# EAGLE board video-max3000a (EAGLE 5.11)
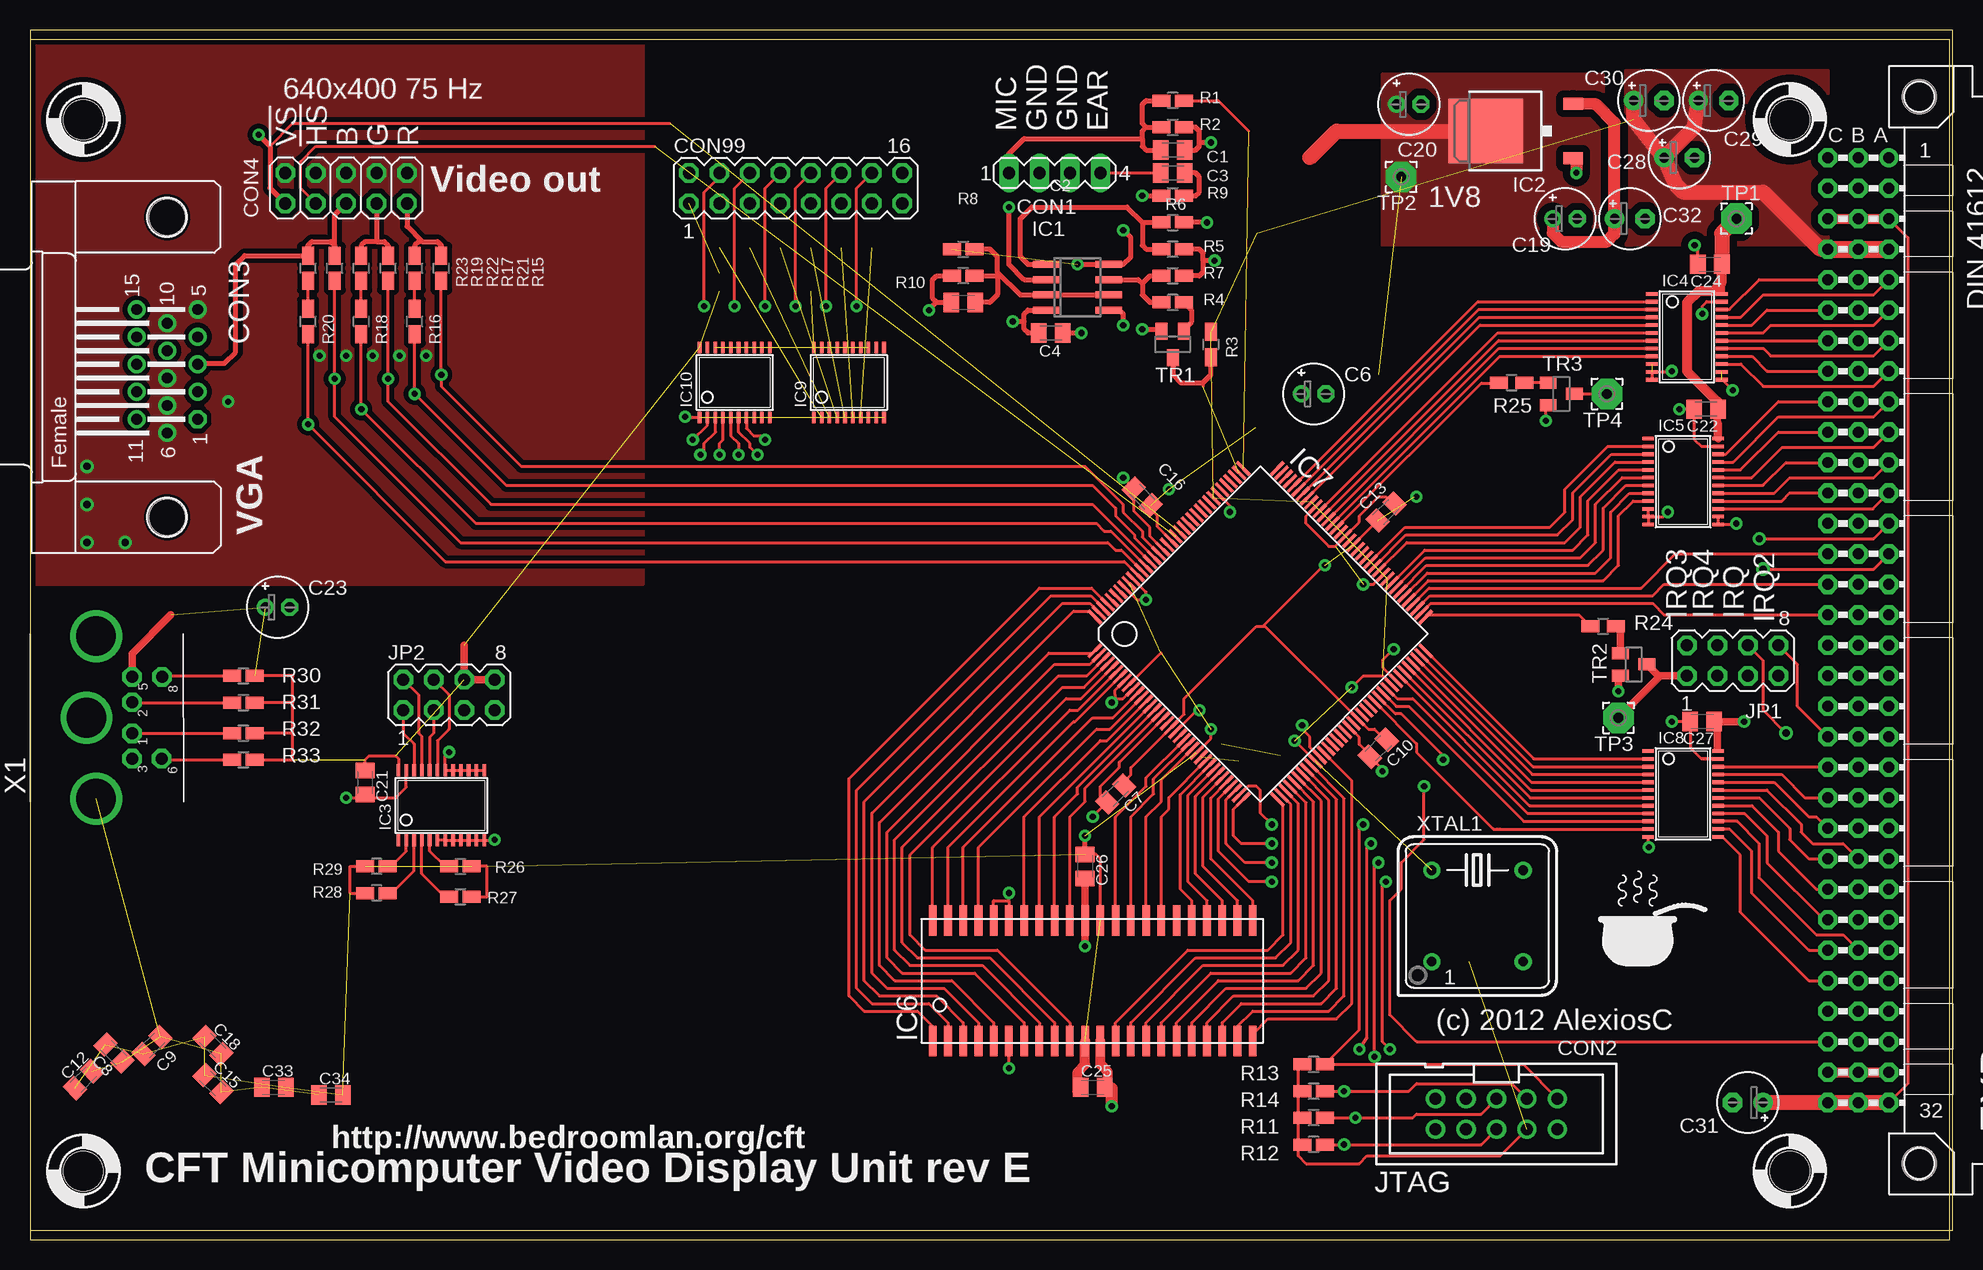
[diagram p4: board, top side]
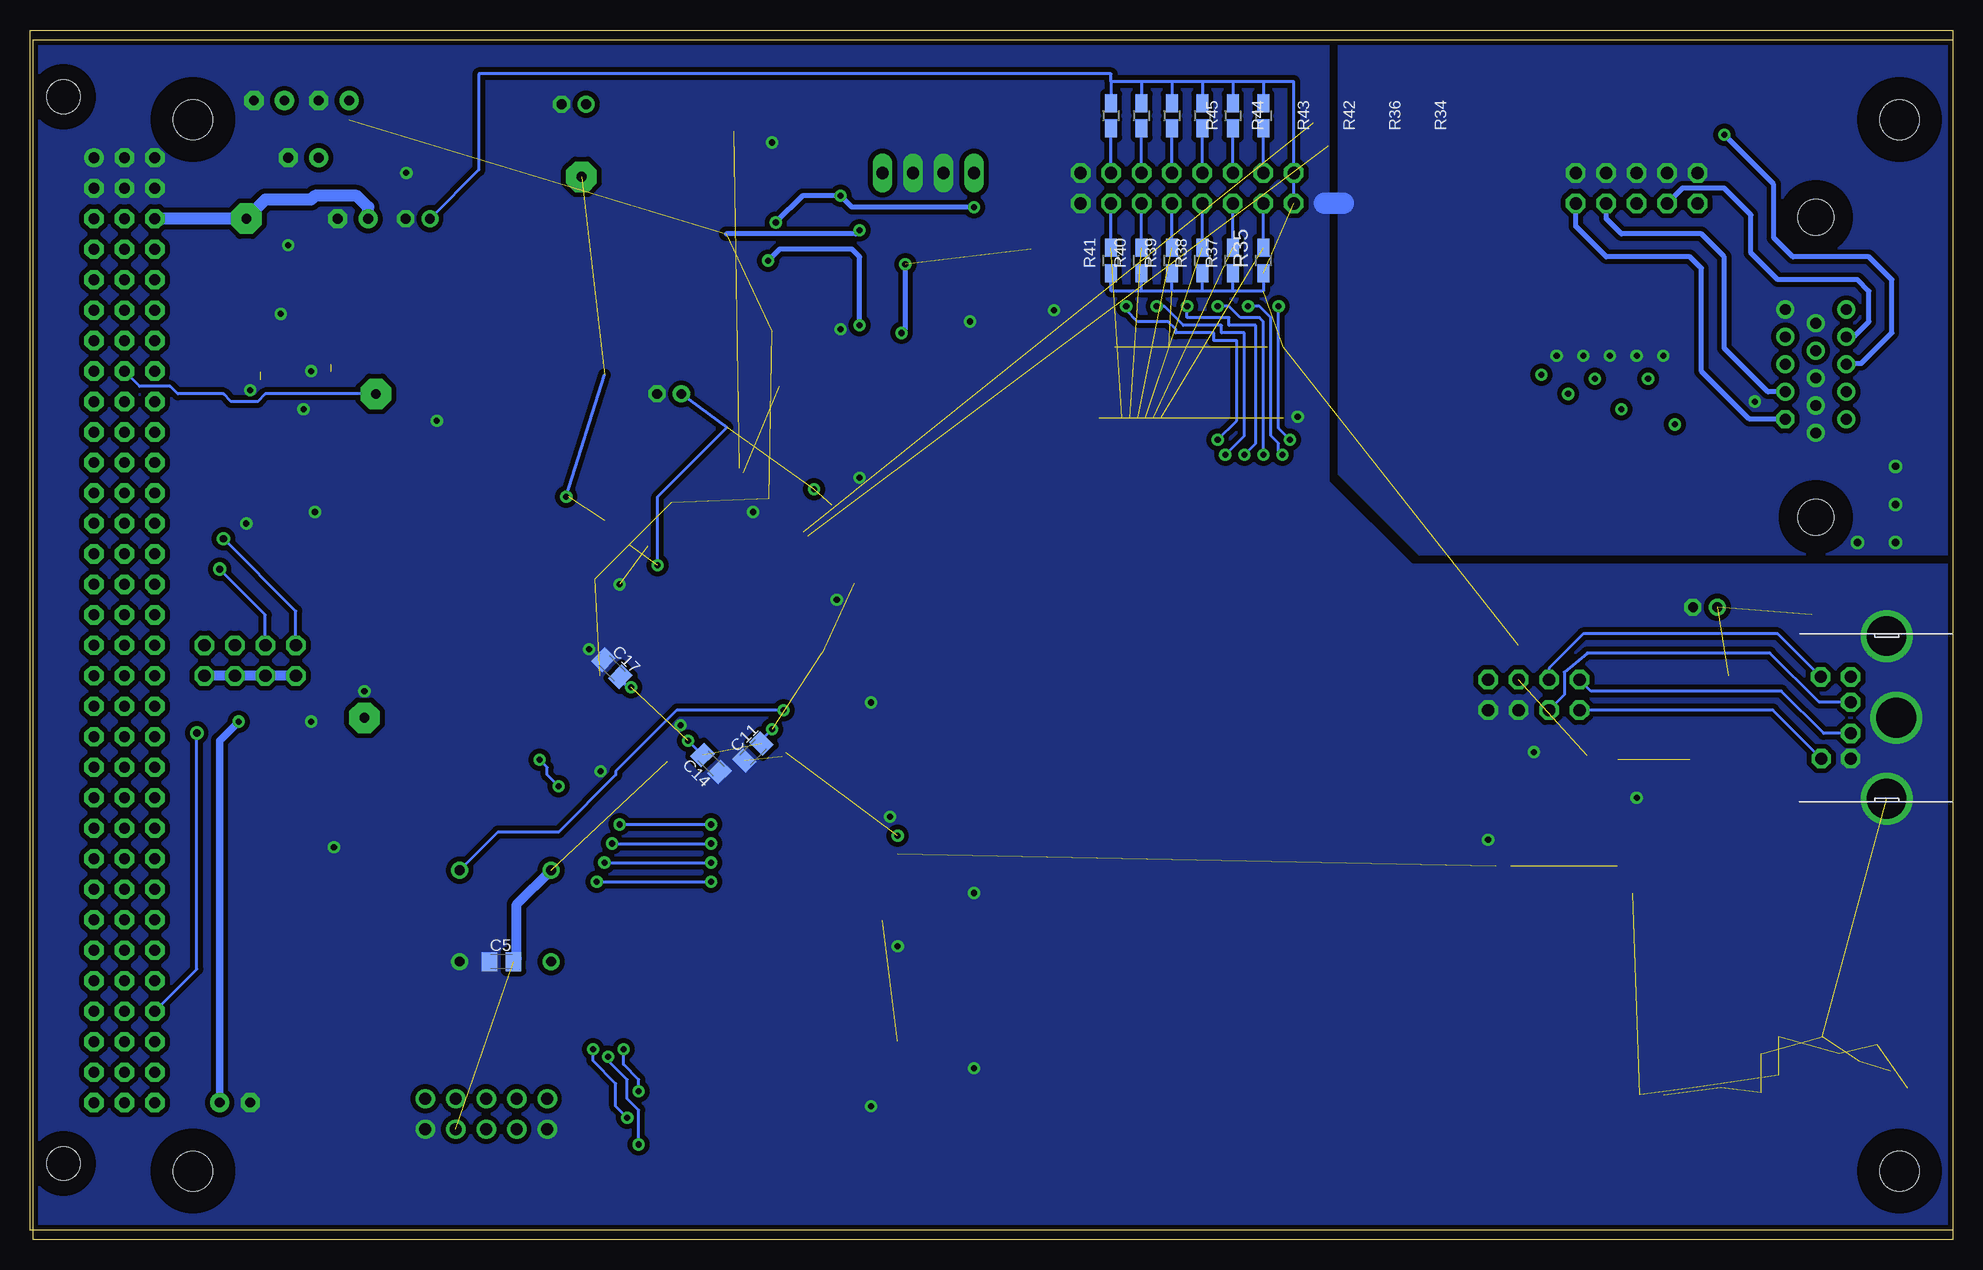
[diagram p5: board, bottom side, seen from below]

Size 160 x 100 mm. Coordinates in mm from the lower left corner, seen from the top.
Outline: 0,0 160,0 160,100 0,100 0,0
Copper layers (1*16): Top 0.035mm / dielectric 1.5mm / Bottom 0.035mm
Design rules "SparkFun": minimum track width 8mil, minimum drill 20mil, track to track 8mil, track to pad 8mil, pad to pad 8mil, via to via 8mil, smd to smd 8mil, copper to edge 10mil, drill to drill 8mil, minimum pad ring 12mil, minimum via ring 10mil, stop-mask expansion 4mil, vias tented up to drill 25mil, thermal gap 10mil
Net classes: 0 default: width 0.254 mm, clearance 0.203 mm; 1 low power: width 1.27 mm, clearance 0.254 mm; 2 LED power: width 1.93 mm, clearance 0.254 mm; 3 3.3V power: width 0.61 mm, clearance 0.203 mm; 4 Analogue: width 0.406 mm, clearance 0.305 mm

## Footprints (pad centres in the part's own frame; a part is rotated, then mirrored left to right if it is on the bottom)
C0805K = smd 1.3 x 1.6: 1 -1,0; 2 1,0
E2-5 = drill 0.813 pad 1.27 round: + -1.016,0 | drill 0.813 pad 1.27 octagon: - 1.016,0
E2,5-5 = drill 0.813 pad 1.6 round: + -1.27,0 | drill 0.813 pad 1.6 octagon: - 1.27,0
MA04-1 = drill 1.016 long: 1 -3.81,0; 2 -1.27,0; 3 1.27,0; 4 3.81,0
SHROUDED-HEADER-2X5-2.5MM = drill 1 pad 1.422 round: 1 -5.08,-1.27; 2 -5.08,1.27; 3 -2.54,-1.27; 4 -2.54,1.27; 5 0,-1.27; 6 0,1.27; 7 2.54,-1.27; 8 2.54,1.27; 9 5.08,-1.27; 10 5.08,1.27
HDF15H = drill 0.9 octagon: 1 4.329,2.54 | drill 0.9 round: 2 2.043,2.54; 3 -0.243,2.54; 4 -2.529,2.54; 5 -4.815,2.54; 6 5.472,0; 7 3.186,0; 8 0.9,0; 9 -1.386,0; 10 -3.672,0; 11 4.329,-2.54; 12 2.043,-2.54; 13 -0.243,-2.54; 14 -2.529,-2.54; 15 -4.815,-2.54 | hole 3: -12.5,0; 12.5,0
2X05 = drill 1.016 octagon: 1 -5.08,-1.27; 2 -5.08,1.27; 3 -2.54,-1.27; 4 -2.54,1.27; 5 0,-1.27; 6 0,1.27; 7 2.54,-1.27; 8 2.54,1.27; 9 5.08,-1.27; 10 5.08,1.27
MA08-2 = drill 1.016 octagon: 1 -8.89,-1.27; 2 -8.89,1.27; 3 -6.35,-1.27; 4 -6.35,1.27; 5 -3.81,-1.27; 6 -3.81,1.27; 7 -1.27,-1.27; 8 -1.27,1.27; 9 1.27,-1.27; 10 1.27,1.27; 11 3.81,-1.27; 12 3.81,1.27; 13 6.35,-1.27; 14 6.35,1.27; 15 8.89,-1.27; 16 8.89,1.27
VG96K = drill 0.914 pad 1.6 round: A1 154.94,39.37 | drill 0.914 pad 1.6 octagon: A2 154.94,36.83; A3 154.94,34.29; A4 154.94,31.75; A5 154.94,29.21; A6 154.94,26.67; A7 154.94,24.13; A8 154.94,21.59; A9 154.94,19.05; A10 154.94,16.51; A11 154.94,13.97; A12 154.94,11.43; A13 154.94,8.89; A14 154.94,6.35; A15 154.94,3.81; A16 154.94,1.27; A17 154.94,-1.27; A18 154.94,-3.81; A19 154.94,-6.35; A20 154.94,-8.89; A21 154.94,-11.43; A22 154.94,-13.97; A23 154.94,-16.51; A24 154.94,-19.05; A25 154.94,-21.59; A26 154.94,-24.13; A27 154.94,-26.67; A28 154.94,-29.21; A29 154.94,-31.75; A30 154.94,-34.29; A31 154.94,-36.83; A32 154.94,-39.37; B1 152.4,39.37; B2 152.4,36.83; B3 152.4,34.29; B4 152.4,31.75; B5 152.4,29.21; B6 152.4,26.67; B7 152.4,24.13; B8 152.4,21.59; B9 152.4,19.05; B10 152.4,16.51; B11 152.4,13.97; B12 152.4,11.43; B13 152.4,8.89; B14 152.4,6.35; B15 152.4,3.81; B16 152.4,1.27; B17 152.4,-1.27; B18 152.4,-3.81; B19 152.4,-6.35; B20 152.4,-8.89; B21 152.4,-11.43; B22 152.4,-13.97; B23 152.4,-16.51; B24 152.4,-19.05; B25 152.4,-21.59; B26 152.4,-24.13; B27 152.4,-26.67; B28 152.4,-29.21; B29 152.4,-31.75; B30 152.4,-34.29; B31 152.4,-36.83; B32 152.4,-39.37; C1 149.86,39.37; C2 149.86,36.83; C3 149.86,34.29; C4 149.86,31.75; C5 149.86,29.21; C6 149.86,26.67; C7 149.86,24.13; C8 149.86,21.59; C9 149.86,19.05; C10 149.86,16.51; C11 149.86,13.97; C12 149.86,11.43; C13 149.86,8.89; C14 149.86,6.35; C15 149.86,3.81; C16 149.86,1.27; C17 149.86,-1.27; C18 149.86,-3.81; C19 149.86,-6.35; C20 149.86,-8.89; C21 149.86,-11.43; C22 149.86,-13.97; C23 149.86,-16.51; C24 149.86,-19.05; C25 149.86,-21.59; C26 149.86,-24.13; C27 149.86,-26.67; C28 149.86,-29.21; C29 149.86,-31.75; C30 149.86,-34.29; C31 149.86,-36.83; C32 149.86,-39.37 | hole 2.794: 157.48,44.45; 157.48,-44.45
STANDOFF_28_60 = hole 3.302: 0,0
SO08 = smd 0.6 x 2.2: 1 -1.905,-2.6; 2 -0.635,-2.6; 3 0.635,-2.6; 4 1.905,-2.6; 5 1.905,2.6; 6 0.635,2.6; 7 -0.635,2.6; 8 -1.905,2.6
TO252 = smd 1 x 1.6: 1 -2.28,-4.8; 2 2.28,-4.8 | smd 5.4 x 6.2: 3 0,2.5
TSSOP24@2 = smd 0.305 x 0.991: 1 -3.575,-2.918; 2 -2.925,-2.918; 3 -2.275,-2.918; 4 -1.625,-2.918; 5 -0.975,-2.918; 6 -0.325,-2.918; 7 0.325,-2.918; 8 0.975,-2.918; 9 1.625,-2.918; 10 2.275,-2.918; 11 2.925,-2.918; 12 3.575,-2.918; 13 3.575,2.918; 14 2.925,2.918; 15 2.275,2.918; 16 1.625,2.918; 17 0.975,2.918; 18 0.325,2.918; 19 -0.325,2.918; 20 -0.975,2.918; 21 -1.625,2.918; 22 -2.275,2.918; 23 -2.925,2.918; 24 -3.575,2.918
TSSOP24@1 = smd 0.305 x 0.991: 1 -3.575,-2.918; 2 -2.925,-2.918; 3 -2.275,-2.918; 4 -1.625,-2.918; 5 -0.975,-2.918; 6 -0.325,-2.918; 7 0.325,-2.918; 8 0.975,-2.918; 9 1.625,-2.918; 10 2.275,-2.918; 11 2.925,-2.918; 12 3.575,-2.918; 13 3.575,2.918; 14 2.925,2.918; 15 2.275,2.918; 16 1.625,2.918; 17 0.975,2.918; 18 0.325,2.918; 19 -0.325,2.918; 20 -0.975,2.918; 21 -1.625,2.918; 22 -2.275,2.918; 23 -2.925,2.918; 24 -3.575,2.918
SOJ44-4 = smd 0.635 x 2.54: 1 -10.16,-5.029; 2 -8.89,-5.029; 3 -7.62,-5.029; 4 -6.35,-5.029; 5 -5.08,-5.029; 6 -3.81,-5.029; 7 -2.54,-5.029; 8 -1.27,-5.029; 9 0,-5.029; 10 1.27,-5.029; 11 2.54,-5.029; 12 3.81,-5.029; 13 5.08,-5.029; 14 6.35,-5.029; 15 7.62,-5.029; 16 8.89,-5.029; 17 10.16,-5.029; 18 11.43,-5.029; 19 12.7,-5.029; 20 13.97,-5.029; 21 15.24,-5.029; 22 16.51,-5.029; 23 16.51,5.029; 24 15.24,5.029; 25 13.97,5.029; 26 12.7,5.029; 27 11.43,5.029; 28 10.16,5.029; 29 8.89,5.029; 30 7.62,5.029; 31 6.35,5.029; 32 5.08,5.029; 33 3.81,5.029; 34 2.54,5.029; 35 1.27,5.029; 36 0,5.029; 37 -1.27,5.029; 38 -2.54,5.029; 39 -3.81,5.029; 40 -5.08,5.029; 41 -6.35,5.029; 42 -7.62,5.029; 43 -8.89,5.029; 44 -10.16,5.029
TQFP144 = smd 0.27 x 1.5: 1 -8.75,-10.75; 2 -8.25,-10.75; 3 -7.75,-10.75; 4 -7.25,-10.75; 5 -6.75,-10.75; 6 -6.25,-10.75; 7 -5.75,-10.75; 8 -5.25,-10.75; 9 -4.75,-10.75; 10 -4.25,-10.75; 11 -3.75,-10.75; 12 -3.25,-10.75; 13 -2.75,-10.75; 14 -2.25,-10.75; 15 -1.75,-10.75; 16 -1.25,-10.75; 17 -0.75,-10.75; 18 -0.25,-10.75; 19 0.25,-10.75; 20 0.75,-10.75; 21 1.25,-10.75; 22 1.75,-10.75; 23 2.25,-10.75; 24 2.75,-10.75; 25 3.25,-10.75; 26 3.75,-10.75; 27 4.25,-10.75; 28 4.75,-10.75; 29 5.25,-10.75; 30 5.75,-10.75; 31 6.25,-10.75; 32 6.75,-10.75; 33 7.25,-10.75; 34 7.75,-10.75; 35 8.25,-10.75; 36 8.75,-10.75; 73 8.75,10.75; 74 8.25,10.75; 75 7.75,10.75; 76 7.25,10.75; 77 6.75,10.75; 78 6.25,10.75; 79 5.75,10.75; 80 5.25,10.75; 81 4.75,10.75; 82 4.25,10.75; 83 3.75,10.75; 84 3.25,10.75; 85 2.75,10.75; 86 2.25,10.75; 87 1.75,10.75; 88 1.25,10.75; 89 0.75,10.75; 90 0.25,10.75; 91 -0.25,10.75; 92 -0.75,10.75; 93 -1.25,10.75; 94 -1.75,10.75; 95 -2.25,10.75; 96 -2.75,10.75; 97 -3.25,10.75; 98 -3.75,10.75; 99 -4.25,10.75; 100 -4.75,10.75; 101 -5.25,10.75; 102 -5.75,10.75; 103 -6.25,10.75; 104 -6.75,10.75; 105 -7.25,10.75; 106 -7.75,10.75; 107 -8.25,10.75; 108 -8.75,10.75 | smd 1.5 x 0.27: 37 10.75,-8.75; 38 10.75,-8.25; 39 10.75,-7.75; 40 10.75,-7.25; 41 10.75,-6.75; 42 10.75,-6.25; 43 10.75,-5.75; 44 10.75,-5.25; 45 10.75,-4.75; 46 10.75,-4.25; 47 10.75,-3.75; 48 10.75,-3.25; 49 10.75,-2.75; 50 10.75,-2.25; 51 10.75,-1.75; 52 10.75,-1.25; 53 10.75,-0.75; 54 10.75,-0.25; 55 10.75,0.25; 56 10.75,0.75; 57 10.75,1.25; 58 10.75,1.75; 59 10.75,2.25; 60 10.75,2.75; 61 10.75,3.25; 62 10.75,3.75; 63 10.75,4.25; 64 10.75,4.75; 65 10.75,5.25; 66 10.75,5.75; 67 10.75,6.25; 68 10.75,6.75; 69 10.75,7.25; 70 10.75,7.75; 71 10.75,8.25; 72 10.75,8.75; 109 -10.75,8.75; 110 -10.75,8.25; 111 -10.75,7.75; 112 -10.75,7.25; 113 -10.75,6.75; 114 -10.75,6.25; 115 -10.75,5.75; 116 -10.75,5.25; 117 -10.75,4.75; 118 -10.75,4.25; 119 -10.75,3.75; 120 -10.75,3.25; 121 -10.75,2.75; 122 -10.75,2.25; 123 -10.75,1.75; 124 -10.75,1.25; 125 -10.75,0.75; 126 -10.75,0.25; 127 -10.75,-0.25; 128 -10.75,-0.75; 129 -10.75,-1.25; 130 -10.75,-1.75; 131 -10.75,-2.25; 132 -10.75,-2.75; 133 -10.75,-3.25; 134 -10.75,-3.75; 135 -10.75,-4.25; 136 -10.75,-4.75; 137 -10.75,-5.25; 138 -10.75,-5.75; 139 -10.75,-6.25; 140 -10.75,-6.75; 141 -10.75,-7.25; 142 -10.75,-7.75; 143 -10.75,-8.25; 144 -10.75,-8.75
TSSOP20 = smd 0.305 x 0.991: 1 -2.925,-2.918; 2 -2.275,-2.918; 3 -1.625,-2.918; 4 -0.975,-2.918; 5 -0.325,-2.918; 6 0.325,-2.918; 7 0.975,-2.918; 8 1.625,-2.918; 9 2.275,-2.918; 10 2.925,-2.918; 11 2.925,2.918; 12 2.275,2.918; 13 1.625,2.918; 14 0.975,2.918; 15 0.325,2.918; 16 -0.325,2.918; 17 -0.975,2.918; 18 -1.625,2.918; 19 -2.275,2.918; 20 -2.925,2.918
MA04-2 = drill 1.016 octagon: 1 -3.81,-1.27; 2 -3.81,1.27; 3 -1.27,-1.27; 4 -1.27,1.27; 5 1.27,-1.27; 6 1.27,1.27; 7 3.81,-1.27; 8 3.81,1.27
R0805W = smd 1.5 x 1: 1 -0.94,0; 2 0.94,0
R0805W' = smd 1.5 x 1: 1 -1.052,0; 2 1.052,0
2,54/0,8 = drill 0.813 pad 2.54 octagon: 1 0,0
SOT23 = smd 1 x 1.4: 1 -0.95,-1.1; 2 0.95,-1.1; 3 0,1.1
M_DIN6 = drill 1 pad 1.422 octagon: 1 -1.3,-3.75; 2 1.3,-3.75; 3 -3.4,-3.75; 5 3.4,-3.75; 6 -3.4,-6.2; 8 3.4,-6.25 | drill 3.3 pad 3.5 round: SH1 6.8,-0.75; SH2 0,0.05; SH3 -6.75,-0.75
DIL08S = drill 0.813 round: 1 -3.81,-3.81; 4 3.81,-3.81; 5 3.81,3.81; 8 -3.81,3.81

## Placement (x,y rotation side)
C1  100nF  [C0805K]  95.25,90.81 0 top
C2  100nF  [C0805K]  77.79,78.11 180 top
C3  47nF  [C0805K]  95.25,88.9 180 top
C4  0.1uF  [C0805K]  85.09,75.56 0 top
C5  0.1uF  [C0805K]  120.97,23.18 0 bottom
C6  10uF  [E2-5]  107,70.48 0 top
C7  0.1uF  [C0805K]  90.49,37.15 45 top
C8  0.1uF  [C0805K]  6.99,15.56 135 top
C9  0.1uF  [C0805K]  10.16,16.19 45 top
C10  0.1uF  [C0805K]  112.39,40.96 45 top
C11  0.1uF  [C0805K]  100.01,40.64 45 bottom
C12  0.1uF  [C0805K]  4.45,13.34 45 top
C13  0.1uF  [C0805K]  113.03,60.64 225 top
C14  0.1uF  [C0805K]  103.5,39.69 135 bottom
C15  0.1uF  [C0805K]  15.24,13.02 315 top
C16  0.1uF  [C0805K]  92.71,61.91 315 top
C17  0.1uF  [C0805K]  111.76,47.62 315 bottom
C18  0.1uF  [C0805K]  15.24,16.19 315 top
C19  10uF  [E2-5]  127.95,85.09 0 top
C20  22uF  [E2-5]  114.94,94.61 0 top
C21  0.1uF  [C0805K]  27.94,38.1 270 top
C22  0.1uF  [C0805K]  139.7,69.22 180 top
C23  10uF  [E2-5]  20.64,52.7 0 top
C24  0.1uF  [C0805K]  140.02,81.28 180 top
C25  0.1uF  [C0805K]  88.58,12.7 0 top
C26  0.1uF  [C0805K]  87.95,31.11 270 top
C27  0.1uF  [C0805K]  139.38,43.18 180 top
C28  1uF  [E2,5-5]  137.48,90.17 0 top
C29  1uF  [E2,5-5]  140.34,94.93 0 top
C30  1uF  [E2,5-5]  134.94,94.93 0 top
C31  1uF  [E2,5-5]  143.19,11.43 180 top
C32  1uF  [E2,5-5]  133.35,85.09 0 top
C33  0.1uF  [C0805K]  20.32,12.7 0 top
C34  0.1uF  [C0805K]  25.08,12.06 0 top
CON1  [MA04-1]  85.41,88.9 0 top
CON2  JTAG-ALTERA  [SHROUDED-HEADER-2X5-2.5MM]  122.24,10.48 180 top
CON3  [HDF15H]  11.43,72.71 270 top
CON4  [2X05]  26.35,87.63 180 top
CON99  [MA08-2]  63.82,87.63 0 top
EXP  [VG96K]  0,50.8 0 top
H1  HOLE  [STANDOFF_28_60]  4.45,93.34 0 top
H2  HOLE  [STANDOFF_28_60]  146.69,93.34 0 top
H3  HOLE  [STANDOFF_28_60]  146.69,5.71 0 top
H4  HOLE  [STANDOFF_28_60]  4.45,5.71 0 top
IC1  LM358MX  [SO08]  87.31,79.38 270 top
IC2  AP1117D18  [TO252]  123.83,92.39 90 top
IC3  IDTQS3861PA  [TSSOP24@2]  34.29,36.2 0 top
IC4  IDTQS3861PA  [TSSOP24@1]  138.11,75.25 270 top
IC5  IDTQS3861PA  [TSSOP24@1]  137.79,63.18 270 top
IC6  AS7C34098A  [SOJ44-4]  85.41,21.59 0 top
IC7  5M570ZT144  [TQFP144]  102.55,50.48 315 top
IC8  IDTQS3861PA  [TSSOP24@1]  137.79,37.15 270 top
IC9  74LCX541MTC  [TSSOP20]  68.26,71.44 0 top
IC10  74LCX541MTC  [TSSOP20]  58.74,71.44 0 top
JP1  [MA04-2]  141.92,48.26 0 top
JP2  [MA04-2]  34.92,45.4 0 top
R1  22k  [R0805W]  95.25,94.93 180 top
R2  10k  [R0805W]  95.25,92.71 0 top
R3  4k7  [R0805W']  98.42,74.61 270 top
R4  10k  [R0805W]  95.25,78.11 180 top
R5  1k  [R0805W]  95.25,82.55 180 top
R6  22k  [R0805W]  95.25,84.77 0 top
R7  100k  [R0805W]  95.25,80.33 0 top
R8  10k  [R0805W]  77.79,82.55 0 top
R9  10k  [R0805W]  95.25,87 0 top
R10  10k  [R0805W]  77.79,80.33 180 top
R11  4k7  [R0805W]  107,10.16 180 top
R12  4k7  [R0805W]  107,7.94 180 top
R13  4k7  [R0805W]  107,14.61 180 top
R14  4k7  [R0805W]  107,12.38 180 top
R15  412R  [R0805W']  34.29,80.96 90 top
R16  412R  [R0805W']  32.07,76.52 90 top
R17  412R  [R0805W']  29.84,80.96 90 top
R18  412R  [R0805W']  27.62,76.52 90 top
R19  412R  [R0805W']  25.4,80.96 90 top
R20  412R  [R0805W']  23.18,76.52 90 top
R21  412R  [R0805W']  32.07,80.96 90 top
R22  412R  [R0805W']  27.62,80.96 90 top
R23  412R  [R0805W']  23.18,80.96 90 top
R24  4k7  [R0805W']  131.13,51.12 0 top
R25  4k7  [R0805W']  123.51,71.44 0 top
R26  4k7  [R0805W]  35.88,31.11 0 top
R27  4k7  [R0805W]  35.88,28.57 0 top
R28  4k7  [R0805W]  28.89,28.89 180 top
R29  4k7  [R0805W]  28.89,31.11 180 top
R30  4k7  [R0805W]  17.78,46.99 0 top
R31  4k7  [R0805W]  17.78,44.77 0 top
R32  4k7  [R0805W]  17.78,42.23 0 top
R33  4k7  [R0805W]  17.78,40.01 0 top
R34  4k7  [R0805W']  57.47,93.66 270 bottom
R35  4k7  [R0805W']  57.47,81.6 90 bottom
R36  4k7  [R0805W']  60.01,93.66 270 bottom
R37  4k7  [R0805W']  60.01,81.6 90 bottom
R38  4k7  [R0805W']  62.55,81.6 90 bottom
R39  4k7  [R0805W']  65.09,81.6 90 bottom
R40  4k7  [R0805W']  67.63,81.6 90 bottom
R41  4k7  [R0805W']  70.17,81.6 90 bottom
R42  4k7  [R0805W']  62.55,93.66 270 bottom
R43  4k7  [R0805W']  65.09,93.66 270 bottom
R44  4k7  [R0805W']  67.63,93.66 270 bottom
R45  4k7  [R0805W']  70.17,93.66 270 bottom
TP1  [2,54/0,8]  142.24,85.09 0 top
TP2  [2,54/0,8]  114.3,88.58 180 top
TP3  [2,54/0,8]  132.4,43.5 180 top
TP4  [2,54/0,8]  131.44,70.48 180 top
TR1  BC848  [SOT23]  95.25,74.61 180 top
TR2  BC848  [SOT23]  133.67,47.94 270 top
TR3  BC848  [SOT23]  127.64,70.48 270 top
U$1  SIGNATURESILK  [SIGNATURE]  131.13,22.54 0 top
X1  [M_DIN6]  4.76,43.5 90 top
XTAL1  50.000 MHz  [DIL08S]  120.65,26.99 0 top

## Tracks (layer width: path | path; a pad name or v marks a point on that pad's centre or on a via)
!HS  (via drill 0.51)  (1 unrouted)
  Top 0.254: 20,91.12 21.91,93.03 53.34,93.03
  Top 0.406: CON4.10 20,87.63 20,91.12 v19.05,92.08
  Bottom 0.254: CON3.13 8.82,73.03
  Bottom 0.406: 8.82,73.03 7.62,73.03 5.08,75.56 5.08,80.01 6.99,81.92 13.34,81.92 14.92,83.5 14.92,87.95 v19.05,92.08
!IO
  Top 0.254: IC7.76 116.62,54.29 134.3,54.29 137.16,57.15 EXP.C14
!IODEV1XX
  Top 0.254: EXP.B24 151.13,33.02 148.59,33.02 147.64,33.97 147.64,34.61 144.78,37.47 IC8.19
!IODEV1XX-3V3
  Top 0.254: IC7.69 125.17,38.12 IC8.5
!IRQ  (via drill 0.61)
  Top 0.254: JP1.6 144.46,48.26 144.46,44.13 v146.37,42.23
  Bottom 0.254: v146.37,42.23 146.37,22.54 EXP.C29
!IRQ2
  Top 0.254: JP1.8 147.32,47.94 147.32,44.45 EXP.C20
!IRQ3  (via drill 0.61)
  Top 0.254: v144.15,58.42 153.67,58.42 EXP.A13
  Bottom 0.254: JP1.2 138.11,52.39 v144.15,58.42
!IRQ4  (via drill 0.61)
  Top 0.254: EXP.A14 153.67,55.88 v144.46,55.88
  Bottom 0.254: v144.46,55.88 140.65,52.07 JP1.4
!NPR
  Top 0.254: IC7.12 90.02,42.55 88.9,42.55 79.06,32.7 IC6.41
!NPW
  Top 0.254: IC6.17 95.57,18.1 99.06,21.59 105.73,21.59 107,22.86 107,36.49 IC7.41
!R
  Top 0.254: IC7.75 116.69,53.66 135.25,53.66 136.21,54.61 EXP.C15
!RESET  (via drill 0.51)
  Top 0.254: EXP.C30 115.57,16.51 113.35,18.73 113.35,28.26 114.3,29.21 114.3,31.43 116.2,33.34 v116.2,37.78 | IC7.61 113.82,43.81 114.3,43.81 117.79,40.32 v117.79,40.01
  Bottom 0.254: v116.2,37.78 117.16,38.73 117.16,39.37 v117.79,40.01
!T34
  Top 0.254: EXP.B27 151.13,25.4 148.91,25.4 144.15,30.16 144.15,33.02 142.29,34.87 IC8.15
!T34-3V3
  Top 0.254: IC7.63 113.96,45.09 115.25,45.09 124.81,35.52 IC8.9
!VS  (1 unrouted)
  Top 0.254: CON4.8 22.54,87.63 22.54,89.85 23.81,91.12 52.07,91.12
  Bottom 0.406: CON4.8 22.54,87.63 19.05,87.63 16.83,85.41 16.83,82.23 14.61,80.01 7.94,80.01 6.99,79.06 6.99,76.51 8.26,75.24 CON3.14
!W
  Top 0.254: EXP.C16 136.21,52.07 135.25,53.02 116.76,53.02 IC7.74
!WS
  Top 0.254: TR3.3 TP4.1
  Bottom 0.254: EXP.B8 151.13,71.12 148.59,71.12 147.96,70.48 144.15,70.48 143.51,69.85 141.29,69.85 140.65,70.48 TP4.1
+3V3  (via drill 0.51)  (24 unrouted)
  Top 0.254: 87.31,12.29 C25.1 | R14.2 106.05,12.38 105.73,12.7 | 105.73,12.7 105.73,14.29 106.05,14.61 R13.2 | 105.73,12.7 105.73,10.48 106.05,10.16 | 106.05,10.16 R11.2 | 106.05,10.16 105.73,9.84 105.73,8.26 106.05,7.94 R12.2 | R12.2 105.74,7.95 | IC7.9 94.25,48.9 94.3,48.9 | IC7.25 98.42,41.76 v98.42,42.55 | IC7.46 105.43,41.59 v105.41,41.59 | IC7.64 112.76,46.99 111.12,46.99 v110.17,46.04 | R29.2 26.67,31.11 26.67,28.89 R28.2 | R26.2 38.1,31.11 38.1,28.57 R27.2 | IC6.33 89.22,31.75 88.85,32.12 C26.1 | 105.73,7.62 105.73,6.99 106.36,6.35 110.81,6.35 111.44,6.99 122.56,6.99 CON2.4 | 105.73,7.62 105.41,7.94 | 105.73,7.62 105.74,7.62 R12.2 | 86.04,76.2 86.04,75.61 C4.2
  Top 0.406: C26.1 v87.95,33.66 | v91.12,84.14 91.76,83.5 91.76,81.92 91.12,81.28 IC1.8 v87.31,81.28 | C4.2 v87.63,75.56
  Top 0.813: 87.31,12.29 87.31,13.97 87.95,14.61 IC6.11
  Top 1.27: EXP.C4 149.22,82.55 144.46,87.31 137.79,87.31 137.16,87.95 C28.+ | C28.+ 138.75,92.71 C29.+ | C30.+ 133.67,93.34 C28.+
  Top 1.422: EXP.C4 EXP.B4 EXP.A4
  Bottom 0.254: C11.2 99.31,41.66 v98.42,42.55 | C14.2 v105.41,41.59 | C14.2 | C17.2 110.49,46.04 v110.17,46.04
  Bottom 0.406: v91.12,84.14 91.44,83.82 102.23,83.82 | v87.31,81.28 87.31,75.88 v87.63,75.56
  Bottom 0.813: XTAL1.8 119.7,27.94 119.7,23.45 C5.2
  pour Top (isolate 0.61, no thermals): 149.86,97.47 149.86,82.87 133.03,82.87 133.03,97.47
+12V
  Top 0.813: EXP.C31 EXP.B31 EXP.A31
AB0
  Top 0.254: IC4.21 142.59,76.87 144.46,78.74 153.67,78.74 EXP.A5
AB0-3V3
  Top 0.254: IC7.103 120.75,77.52 IC4.3
AB1
  Top 0.254: IC4.19 144.47,75.57 145.1,76.2 153.67,76.2 EXP.A6
AB1-3V3
  Top 0.254: IC7.101 120.87,76.22 IC4.5
AB2
  Top 0.254: IC4.17 144.49,74.27 145.1,73.66 153.67,73.66 EXP.A7
AB2-3V3
  Top 0.254: IC7.97 122.4,74.92 IC4.7
AB3
  Top 0.254: EXP.A8 153.67,71.12 144.46,71.12 142.61,72.97 IC4.15
AB3-3V3
  Top 0.254: IC4.9 124.14,73.62 124.11,73.62 122.51,73.62 IC7.95
AB4
  Top 0.254: IC5.21 141.96,64.81 145.73,68.58 153.67,68.58 EXP.A9
AB4-3V3
  Top 0.254: IC5.3 131.81,65.46 128.59,62.23 128.59,60.01 127.32,58.74 114.7,58.74 IC7.85
AB5
  Top 0.254: IC5.19 143.52,63.51 146.05,66.04 153.67,66.04 EXP.A10
AB5-3V3
  Top 0.254: IC7.81 116.25,57.47 128.59,57.47 129.86,58.74 129.86,61.59 132.42,64.16 IC5.5
AB6
  Top 0.254: IC5.17 145.39,62.21 146.69,63.5 153.67,63.5 EXP.A11
AB6-3V3
  Top 0.254: IC7.79 116.4,56.2 129.86,56.2 131.13,57.47 131.13,60.96 133.03,62.86 IC5.7
AB7
  Top 0.254: IC5.15 153.62,60.91 EXP.A12
AB7-3V3
  Top 0.254: IC7.77 116.54,54.93 131.13,54.93 132.4,56.2 132.4,60.33 133.63,61.56 IC5.9
B0  (via drill 0.51)
  Top 0.254: R19.1 v25.4,71.75 25.4,68.58 35.88,58.1 89.85,58.1 90.49,57.47 90.97,57.47 IC7.133
B1  (via drill 0.51)
  Top 0.254: IC7.134 91.22,56.52 34.61,56.52 v23.18,67.94 R20.1
BLUE
  Top 0.406: CON4.6 25.4,85.41 25.4,82.87 | 25.4,82.55 R19.2 25.4,82.87 | 25.4,82.87 25.08,83.19 23.5,83.19 23.18,82.87 R23.2 17.88,82.02 17.14,81.28 17.14,73.98 16.19,73.03 14.04,73.03 CON3.3
CG/!P!
  Top 0.254: IC7.6 87.36,44.13 86.68,44.13 75.25,32.7 IC6.44
CLK  (via drill 0.51)
  Top 0.254: IC7.20 97.26,44.13 v97.47,44.13
  Bottom 0.254: v97.47,44.13 106.36,44.13 111.44,39.05 111.44,38.73 116.2,33.97 121.28,33.97 XTAL1.5
DB0
  Top 0.254: IC4.22 141.66,77.52 144.15,80.01 EXP.C5
DB0-3V3
  Top 0.254: IC7.104 120.7,78.17 IC4.2
DB1
  Top 0.254: IC4.20 143.53,76.22 144.78,77.47 EXP.C6
DB1-3V3
  Top 0.254: IC7.102 120.81,76.87 IC4.4
DB2
  Top 0.254: IC4.18 EXP.C7
DB2-3V3
  Top 0.254: IC7.98 122.34,75.57 IC4.6
DB3
  Top 0.254: IC4.16 143.55,73.62 144.78,72.39 EXP.C8
DB3-3V3
  Top 0.254: IC7.96 122.45,74.27 IC4.8
DB4
  Top 0.254: IC5.22 141.34,65.46 145.73,69.85 EXP.C9
DB4-3V3
  Top 0.254: IC5.2 131.51,66.11 127.95,62.55 127.95,60.64 126.68,59.37 114.62,59.37 IC7.86
DB5
  Top 0.254: IC5.20 142.58,64.16 145.73,67.31 EXP.C10
DB5-3V3
  Top 0.254: IC5.4 132.12,64.81 129.22,61.91 129.22,59.37 127.95,58.1 114.77,58.1 IC7.84
DB6
  Top 0.254: IC5.18 144.46,62.86 146.37,64.77 EXP.C11
DB6-3V3
  Top 0.254: IC7.80 116.33,56.83 129.22,56.83 130.49,58.1 130.49,61.28 132.72,63.51 IC5.6
DB7
  Top 0.254: IC5.16 146.01,61.56 146.69,62.23 EXP.C12
DB7-3V3
  Top 0.254: IC5.8 133.33,62.21 131.76,60.64 131.76,56.83 130.49,55.56 116.47,55.56 IC7.78
DB8
  Top 0.254: IC8.22 149.81,39.42 EXP.C21
DB8-3V3
  Top 0.254: IC7.72 125.34,40.07 IC8.2
DB9
  Top 0.254: IC8.21 146.01,38.77 147.96,36.83 EXP.C22
DB9-3V3
  Top 0.254: IC7.71 125.28,39.42 IC8.3
DB10
  Top 0.254: IC8.20 145.39,38.12 148.27,35.24 148.91,35.24 EXP.C23
DB10-3V3
  Top 0.254: IC7.70 125.22,38.77 IC8.4
DB11
  Top 0.254: EXP.C24 148.27,31.75 146.69,33.34 146.69,34.29 144.15,36.82 IC8.18
DB11-3V3
  Top 0.254: IC7.68 125.11,37.47 IC8.6
DB12
  Top 0.254: EXP.C25 148.91,29.21 145.73,32.38 145.73,33.97 143.53,36.17 IC8.17
DB12-3V3
  Top 0.254: IC7.67 125.05,36.82 IC8.7
DB13
  Top 0.254: EXP.C26 149.54,26.67 144.78,31.43 144.78,33.66 142.91,35.52 IC8.16
DB13-3V3
  Top 0.254: IC7.66 124.99,36.17 IC8.8
DB14
  Top 0.254: EXP.C27 148.27,24.13 143.51,28.89 143.51,32.38 141.67,34.22 IC8.14
DB14-3V3
  Top 0.254: IC7.62 113.89,44.45 114.94,44.45 124.51,34.87 IC8.10
DB15
  Top 0.254: EXP.C28 148.27,21.59 142.56,27.3 142.56,32.07 141.05,33.57 IC8.13
DB15-3V3
  Top 0.254: IC7.60 115.57,41.35 115.57,40.64 121.99,34.22 122.31,34.22 122.56,34.22 IC8.11
EAR
  Top 0.254: CON1.4 C3.2
G0  (via drill 0.51)
  Top 0.254: R17.1 v29.84,71.75 29.84,69.85 38.42,61.28 88.58,61.28 89.85,60.01 89.85,60 IC7.131
G1  (via drill 0.51)
  Top 0.254: R18.1 v27.62,69.22 37.15,59.69 88.9,59.69 89.53,59.05 90.09,59.05 IC7.132
GND  (via drill 0.51, 0.61)  (18 unrouted)
  Top 0.254: IC7.54 110.81,41.87 110.81,41.27 111.69,40.4 C10.1 112.71,39.23 v112.71,39.05 | C24.2 139.02,82.6 v138.75,82.87 | IC2.1 128.85,90.11 arc90 128.91,90.17 128.91,89.85 | TR2.2 132.4,46.82 | 139.45,40.07 IC8.23 139.31,40.07 138.43,40.96 138.43,43.13 C27.2 138.11,43.45 137.84,43.18 v136.84,43.18 | IC7.83 111.98,54.61 v111.12,54.61 | IC7.99 106.36,60.3 106.36,59.69 108.27,57.78 108.79,57.78 IC7.92 110.81,59.8 110.81,60.33 112.39,61.91 113.03,61.91 113.59,61.35 C13.1 | C25.2 89.85,12.29 | IC6.40 80.33,28.26 81.6,28.26 | 81.6,28.26 IC6.39 | 81.6,28.26 v81.6,28.89 | v81.6,14.29 IC6.6 | v88.58,35.24 C7.1 89.61,36.44 89.22,36.83 89.22,37.78 90.81,39.37 90.81,39.8 IC7.17 | IC7.8 90.43,45.78 90.49,45.09 | 90.49,45.09 91.12,45.09 91.92,45.89 IC7.10 | v90.17,44.77 90.49,45.09 | IC8.12 134.88,32.76 v134.94,32.7 | IC7.137 92.27,53.34 92.71,53.34 93.03,53.66 | 93.03,53.66 93.03,53.98 91.95,55.06 IC7.135 | 93.03,53.66 v93.03,53.34 | IC7.115 100.01,61.15 v100.01,60.64 | IC7.47 106.68,41.05 106.68,41.91 106.05,42.55 v106.05,42.86 | IC7.65 112.78,47.67 112.78,48.33 v113.67,49.21 | v113.67,49.21 | IC7.128 93.34,58.63 93.34,59.37 92,60.72 C16.1 v91.12,63.5 | v91.12,63.5 | IC5.11 IC5.10 | IC5.11 IC5.12 | IC4.12 IC4.11 136.78,72.32 v136.84,72.39 | IC5.11 136.14,60.26 v136.53,60.64 | IC5.14 IC5.13 142.16,59.61 v142.24,59.69 | IC5.23 139.31,66.11 138.75,66.67 138.75,69.17 C22.2 v137.48,69.22 | IC4.23 139.77,78.17 139.38,77.79 v139.38,77.15 | IC3.6 IC3.7 IC3.8 IC3.9 IC3.10 IC3.11 IC3.12 38.67,33.28 v38.73,33.34 | IC3.23 31.36,37.72 30.48,36.83 27.99,36.83 C21.2 27.67,36.83 v26.35,36.83 | IC3.13 IC3.14 IC3.15 IC3.16 IC3.17 IC3.18 34.62,40.33 v34.92,40.64
  Top 0.254: IC4.13 141.05,71.67 v141.92,70.8 | TR3.2 126.36,69.36 v126.36,68.26 | 94.13,75.88 TR1.2 | IC10.1 54.67,68.52 v54.61,68.58
  Top 0.406: R2.2 97.16,92.71 97.47,92.39 97.47,91.44 | 97.47,91.44 97.47,91.12 97.16,90.81 C1.2 | 97.47,91.44 v98.42,91.44 | 75.56,78.11 C2.2 | 75.56,78.11 75.25,78.42 75.25,80.01 75.56,80.33 R10.2 | v74.93,77.47 75.56,78.11 | v92.71,75.88 94.13,75.88 | IC1.4 83.19,77.47 82.87,77.15 82.87,76.52 | 82.87,76.52 82.87,75.88 83.19,75.56 C4.1 | 82.87,76.52 v81.92,76.52
  Top 0.61: 132.4,46.82 v132.4,45.72 | C26.2 IC6.34 v87.95,24.45
  Top 0.813: IC6.12 89.22,14.61 89.85,13.97 89.85,12.29
  Top 1.016: 128.91,89.85 v128.91,88.9 | v90.17,11.11 90.17,12.61 C25.2
  Bottom 1.778: 52.39,86.36 50.8,86.36
  other vias: 4.76,58.1 7.94,58.1 4.76,61.28 4.76,64.45 16.51,69.85 24.13,73.66 26.35,73.66 28.57,73.66 30.8,73.66 33.02,73.66
  pour Bottom (isolate 0.406, no thermals): 45.09,56.2 52.07,63.18 52.07,100.97 160.34,100.97 160.02,0 0,0 0,56.2
  pour Bottom (isolate 0.406, no thermals): 51.12,100.65 51.12,63.82 44.45,57.15 0,57.15 0,100.65
  pour Top (isolate 0.406, no thermals): 51.12,100.65 51.12,54.61 0,54.61 0,100.65
GREEN
  Top 0.406: R22.2 27.62,82.87 27.94,83.19 28.89,83.19 | 28.89,83.19 29.53,83.19 29.84,82.87 R17.2 | CON4.4 28.89,83.19
  Bottom 0.406: CON3.2 15.42,70.67 19.05,74.3 19.05,81.92 20.95,83.82 27.62,83.82 28.89,85.09 CON4.4
JB1  (1 unrouted)
JB2  (1 unrouted)
JD  (1 unrouted)
JL  (1 unrouted)
JR  (1 unrouted)
JU  (1 unrouted)
KBCLK
  Top 0.254: IC3.2 31.36,32.38 30.09,31.11 R29.1
KBCLK-5V
  Top 0.254: IC3.22 32.02,41.33 31.11,42.23 JP2.1 | R33.1 11.05,40.01 X1.6
  Bottom 0.254: JP2.1 15,44.13 X1.6
KBDAT
  Top 0.254: IC3.3 32.02,30.75 30.16,28.89 R28.1
KBDAT-5V
  Top 0.254: IC3.21 32.66,41.95 32.38,42.23 32.38,45.4 JP2.2 | R32.1 8.54,42.23 X1.1
  Bottom 0.254: X1.1 10.77,42.2 14.29,45.72 30.16,45.72 JP2.2
MIC
  Top 0.406: C1.1 93.03,90.81 92.71,91.12 92.71,91.76 | CON1.1 81.6,90.49 82.87,91.76 92.71,91.76 | R1.2 93.03,94.93 92.71,94.61 92.71,93.03 93.03,92.71 | 93.03,92.71 R2.1 | 93.03,92.71 92.71,92.39 92.71,91.76
MSCLK
  Top 0.254: IC3.5 33.31,32.38 34.59,31.11 R26.1
MSCLK-5V
  Top 0.254: IC3.19 33.97,41.59 34.92,42.55 34.92,45.4 JP2.4 | R30.1 11.11,46.99 X1.8
  Bottom 0.254: X1.8 14.61,50.48 30.8,50.48 33.66,47.62 JP2.4
MSDAT
  Top 0.254: IC3.4 32.66,30.52 34.29,28.89 34.62,28.89 R27.1
MSDAT-5V
  Top 0.254: IC3.20 33.31,41.89 33.66,42.23 JP2.3 | R31.1 16.83,44.45 16.51,44.77 8.54,44.77 X1.2
  Bottom 0.254: X1.2 11.14,44.8 15.24,48.9 30.48,48.9 32.38,47.31 32.38,45.4 JP2.3
N$1
  Top 0.254: R16.2 R21.1
N$2
  Top 0.254: R18.2 R22.1
N$3
  Top 0.254: R20.2 R23.1
N$4  (via drill 0.51)
  Top 0.254: CON99.4 57.47,88.58 56.2,87.31 v56.2,77.79 | IC10.2 56.46,67.89 v55.24,66.67
  Bottom 0.254: CON99.4 R34.2 | v56.2,77.79 56.2,67.63 v55.24,66.67
N$5  (1 unrouted)
  Bottom 0.254: R35.2 CON99.3
N$6
  Top 0.254: R25.2 TR3.1
N$7  (1 unrouted)
  Bottom 0.254: R37.2 CON99.5
N$8  (1 unrouted)
  Bottom 0.254: R38.2 CON99.7
N$9  (1 unrouted)
  Bottom 0.254: R39.2 CON99.9
N$10  (1 unrouted)
  Bottom 0.254: R40.2 CON99.11
N$11  (1 unrouted)
  Bottom 0.254: R41.2 CON99.13
N$12  (via drill 0.51)
  Top 0.254: CON99.6 58.74,87.63 v58.74,77.79 | IC10.3 57.15,68.48 57.15,67.31 56.2,66.36 56.2,65.72 v55.88,65.41
  Bottom 0.254: CON99.6 R36.2 | v58.74,77.79 57.78,77.79 56.83,76.83 56.83,66.99 56.2,66.36 56.2,65.72 v55.88,65.41
N$13  (via drill 0.51)
  Top 0.254: CON99.8 61.28,87.63 v61.28,77.79 | 57.78,68.5 IC10.4 57.76,66.65 57.47,66.36 v57.47,65.41
  Bottom 0.254: CON99.8 R42.2 | v61.28,77.79 60.33,77.79 59.37,76.83 57.78,76.83 57.47,76.52 v57.47,65.41
N$14  (via drill 0.51)
  Top 0.254: CON99.10 63.82,87.63 v63.82,77.79 | IC10.5 58.41,67 59.05,66.36 v59.05,65.41
  Bottom 0.254: CON99.10 R43.2 | v63.82,77.79 63.82,76.83 60.33,76.83 60.33,76.2 58.1,76.2 58.1,66.36 v59.05,65.41
N$15  (via drill 0.51)
  Top 0.254: CON99.12 66.36,87.63 v66.36,77.79 | IC10.6 59.06,67.3 60.01,66.36 60.01,66.04 v60.64,65.41
  Bottom 0.254: CON99.12 R44.2 | v66.36,77.79 65.72,77.79 64.14,76.2 60.96,76.2 60.96,75.56 59.05,75.56 59.05,66.99 v60.64,65.41
N$16  (via drill 0.51)
  Top 0.254: CON99.14 68.9,87.63 v68.9,77.79 | IC10.7 59.71,67.61 60.33,66.99 60.96,66.99 v61.28,66.67
  Bottom 0.254: CON99.14 R45.2 | v68.9,77.79 68.9,77.47 67.94,76.52 65.41,76.52 64.77,75.88 64.77,75.56 61.59,75.56 61.59,74.93 59.69,74.93 59.69,68.26 v61.28,66.67
N$79
  Top 0.406: C3.1 97.16,88.9 97.47,88.58 97.47,87.31 97.16,87 R9.2
N$260
  Top 0.61: TR2.3 135.72,46.99 135.89,46.99 | 135.89,46.99 JP1.1 | TP3.1 135.89,46.99
  Bottom 0.813: JP1.7 JP1.5 JP1.3 JP1.1
N$507  (via drill 0.51)
  Top 0.406: v92.71,87 R9.1 | v98.11,84.77 R6.2 | v81.6,86.04 81.6,81.28 82.87,80.01 IC1.2
  Bottom 0.406: v98.11,84.77 95.89,87 v92.71,87 91.76,86.04 v81.6,86.04
N$527  (via drill 0.51)
  Top 0.254: IC1.5 90.81,77.47
  Top 0.406: R5.1 97.47,82.55 97.79,82.23 97.79,81.6 | R7.2 97.47,80.33 97.79,80.64 97.79,81.6 | 90.81,77.47 91.12,77.15 v91.12,76.2 | v98.74,81.6 97.79,81.6
  Bottom 0.406: v98.74,81.6 97.79,82.55 91.76,82.55 91.12,81.92 v91.12,76.2
N$769
  Top 0.406: R7.1 93.34,80.33 92.71,79.69 | 92.71,79.69 92.71,78.74 93.34,78.11 R4.2 | IC1.7 92.39,80.01 92.71,79.69
N$770
  Top 0.254: R4.1
  Top 0.406: TR1.1 96.2,75.88 96.84,76.52 96.84,77.46 R4.1
N$771
  Top 0.254: 80.64,80.33 80.64,80.64
  Top 0.406: C2.1 80.01,78.11 80.64,78.74 80.64,80.33 R10.1 | R8.2 80.01,82.55 80.64,81.92 80.64,80.64 82.55,78.74 IC1.3 IC1.6
N$791
  Top 0.406: 92.71,84.77 R6.1 | IC1.1 83.19,81.28 82.55,81.92 82.55,85.09 83.5,86.04 91.44,86.04 92.71,84.77 | R5.2 93.03,82.55 92.71,82.87 92.71,84.77
N$843
  Top 0.61: TR2.1 132.57,50.73 R24.2
PA0
  Top 0.254: IC6.1 75.25,17.78 73.98,19.05 69.53,19.05 68.26,20.32 68.26,38.42 84.14,54.29 88.49,54.29 IC7.141
PA1
  Top 0.254: IC6.2 76.52,18.1 74.93,19.68 70.17,19.68 68.9,20.95 68.9,37.47 85.09,53.66 88.42,53.66 IC7.142
PA2
  Top 0.254: IC6.3 77.79,18.1 75.56,20.32 70.8,20.32 69.53,21.59 69.53,36.51 86.04,53.02 88.34,53.02 IC7.143
PA3
  Top 0.254: IC6.4 79.06,18.1 76.2,20.95 71.44,20.95 70.17,22.23 70.17,35.56 87,52.39 88.27,52.39 IC7.144
PA4
  Top 0.254: IC6.5 80.33,18.1 76.83,21.59 72.07,21.59 70.8,22.86 70.8,34.77 84.93,48.9 88.58,48.9 IC7.1
PA5
  Top 0.254: IC6.18 96.84,18.1 99.69,20.95 106.36,20.95 107.63,22.23 107.63,36.56 IC7.42
PA6
  Top 0.254: IC6.19 98.11,18.1 100.33,20.32 107,20.32 108.27,21.59 108.27,36.64 IC7.43
PA7
  Top 0.254: IC6.20 99.38,18.1 100.97,19.68 107.63,19.68 108.9,20.95 108.9,36.71 IC7.44
PA8
  Top 0.254: IC6.21 100.65,17.78 101.92,19.05 108.27,19.05 109.54,20.32 109.54,36.78 IC7.45
PA9
  Top 0.254: IC6.22 101.92,17.14 103.19,18.41 108.9,18.41 110.17,19.68 110.17,38.27 IC7.48
PA10
  Top 0.254: IC7.32 98.42,36.81 98.42,31.75 101.92,28.26 IC6.23
PA11
  Top 0.254: IC7.31 97.79,36.88 97.79,31.11 100.65,28.26 IC6.24
PA12
  Top 0.254: IC7.30 97.16,36.95 97.16,30.48 99.38,28.26 IC6.25
PA13
  Top 0.254: IC6.26 98.11,28.26 96.52,29.84 96.52,37.02 IC7.29
PA14
  Top 0.254: IC7.28 95.89,37.1 95.89,29.21 96.84,28.26 IC6.27
PA15
  Top 0.254: IC6.42 77.79,32.7 88.58,43.5 90.26,43.5 IC7.11
PB/!PC!
  Top 0.254: IC7.7 87.12,43.18 87,43.18 76.52,32.7 IC6.43
PD0
  Top 0.254: IC6.7 82.87,18.1 78.74,22.23 72.71,22.23 71.44,23.5 71.44,33.97 85.41,47.94 88.34,47.94 IC7.2
PD1
  Top 0.254: IC6.8 84.14,18.1 79.38,22.86 73.34,22.86 72.07,24.13 72.07,33.34 85.72,46.99 88.1,46.99 IC7.3
PD2
  Top 0.254: IC6.9 85.41,18.1 80.01,23.5 73.98,23.5 72.71,24.77 72.71,32.7 86.04,46.04 87.85,46.04 IC7.4
PD3
  Top 0.254: IC6.10 86.68,18.1 80.64,24.13 74.61,24.13 73.34,25.4 73.34,32.07 86.36,45.09 87.61,45.09 IC7.5
PD4
  Top 0.254: IC6.13 90.49,18.1 96.52,24.13 103.19,24.13 104.46,25.4 104.46,36.2 IC7.37
PD5
  Top 0.254: IC6.14 91.76,18.1 97.16,23.5 103.82,23.5 105.09,24.77 105.09,36.27 IC7.38
PD6
  Top 0.254: IC6.15 93.03,18.1 97.79,22.86 104.46,22.86 105.73,24.13 105.73,36.35 IC7.39
PD7
  Top 0.254: IC6.16 94.3,18.1 98.42,22.23 105.09,22.23 106.36,23.5 106.36,36.42 IC7.40
PD8
  Top 0.254: IC7.27 94.93,36.85 94.93,35.88 94.3,35.24 IC6.29
PD9
  Top 0.254: IC7.24 94.3,38.34 94.3,36.51 93.03,35.24 IC6.30
PD10
  Top 0.254: IC7.23 93.66,38.41 93.66,37.15 91.76,35.24 IC6.31
PD11
  Top 0.254: IC7.22 93.03,38.48 93.03,37.78 90.49,35.24 IC6.32
PD12
  Top 0.254: IC7.16 87.95,37.65 87.95,36.51 86.68,35.24 IC6.35
PD13
  Top 0.254: IC7.15 87.31,37.72 87.31,37.15 85.41,35.24 IC6.36
PD14
  Top 0.254: IC7.14 85.41,36.52 85.41,36.51 84.14,35.24 IC6.37
PD15
  Top 0.254: IC7.13 89.77,41.59 89.22,41.59 82.87,35.24 IC6.38
R0  (via drill 0.51)
  Top 0.254: R15.1 v34.29,72.07 34.29,71.44 34.29,71.12 40.96,64.45 87.95,64.45 91.12,61.28 91.12,60.64 92.71,59.05 92.71,58.56 IC7.129
R1  (via drill 0.51)
  Top 0.254: R16.1 v32.07,70.48 39.69,62.87 88.58,62.87 90.49,60.96 90.49,60.33 92.08,58.74 92.08,58.48 IC7.130
RED
  Top 0.406: R21.2 32.07,82.87 32.38,83.19 32.7,83.19 | 32.7,83.19 33.97,83.19 34.29,82.87 R15.2 | CON4.2 31.43,84.45 32.7,83.19
  Bottom 0.406: CON3.1 16.94,68.38 20.95,72.39 20.95,80.96 21.91,81.92 28.89,81.92 31.43,84.45 CON4.2
TAPEIN  (1 unrouted)
  Top 0.254: 97.79,71.44 97.79,71.12
  Top 0.406: R3.2 98.42,72.07 97.79,71.44 95.89,71.44 95.25,72.07 TR1.3
TAPEOUT  (1 unrouted)
  Top 0.254: 101.6,92.39 99.06,94.93 R1.1
TCK  (via drill 0.51)
  Top 0.254: CON2.1 124.46,14.61 107.95,14.63 | IC7.35 101.52,37.78 102.23,37.78 102.55,37.47 102.55,35.56 v103.5,34.61 | v111.12,34.61 110.81,34.29 110.81,17.49 107.95,14.63 | 108.27,14.61 R13.1 107.96,14.63 107.95,14.63
  Bottom 0.254: v111.12,34.61 v103.5,34.61
TDI  (via drill 0.51)
  Top 0.254: IC7.34 99.69,36.66 99.69,33.02 101.28,31.43 v103.5,31.43 | v112.08,15.24 112.08,31.11 v112.39,31.43 | R12.1 v109.54,7.94 120.97,7.94 CON2.6
  Bottom 0.254: v112.39,31.43 v103.5,31.43 | v112.08,15.24 112.08,14.92 110.49,13.34 110.49,11.75 109.54,10.79 v109.54,7.94
TDO  (via drill 0.51)
  Top 0.254: CON2.3 123.51,13.02 115.57,13.02 114.94,12.38 v109.54,12.38 R14.1 | IC7.36 100.33,35.89 100.33,33.66 100.97,33.02 v103.5,33.02 | v111.76,33.02 111.44,32.7 111.44,16.83 v110.81,15.88
  Bottom 0.254: v111.76,33.02 v103.5,33.02 | v110.81,15.88 110.81,14.61 109.54,13.34 v109.54,12.38
TMS  (via drill 0.51)
  Top 0.254: R11.1 v110.49,10.16 115.25,10.16 115.57,10.48 120.97,10.48 CON2.5 | IC7.33 99.06,36.74 99.06,32.38 101.6,29.84 v103.5,29.84 | v113.35,15.88 112.71,16.51 112.71,29.53 v113.03,29.84
  Bottom 0.254: v113.03,29.84 v103.5,29.84 | v113.35,15.88 113.35,14.92 111.44,13.02 111.44,11.11 v110.49,10.16
VCC  (via drill 0.51)  (8 unrouted)
  Top 0.254: IC8.24 140.71,40.9 140.65,40.96 | C24.1 141.03,81.27 | C22.1 140.71,69.2 | 140.97,79.06 141.03,79 IC4.24 141.03,81.22 140.97,81.28 | IC5.24 140.71,66.93 140.65,66.99 | EXP.A3 156.53,83.5 156.53,13.02 EXP.A32 | IC3.24 30.71,40.09 30.48,40.32 28.26,40.32 27.94,40.01 C21.1 | R30.2 21.91,46.99 21.91,44.77 | 21.91,44.77 R31.2 | 21.91,42.23 21.91,44.77 | 21.91,42.23 R32.2 | 21.91,42.23 21.91,40.01 R33.2
  Top 0.61: C27.1 140.71,42.85 | 140.65,40.96 140.65,42.91 C27.1 | 140.97,79.06 140.97,81.23 C24.1 | 140.65,66.99 140.65,69.17 C22.1 | C22.1 140.71,69.23 | 140.65,69.26 C22.1 | v142.88,43.18 C27.1 | IC5.24 140.71,68 | X1.5 8.51,48.84 11.75,52.07 | 36.2,49.53 JP2.6 JP2.8
  Top 0.813: EXP.C3 EXP.B3 EXP.A3 | 140.97,81.28 140.97,79.69 140.34,79.06 139.06,79.06 138.11,78.11 138.11,72.39 140.65,69.85 140.65,69.26
  Top 1.016: IC2.2 130.49,94.61 130.55,94.61 132.08,93.08 C32.+ 132.08,83.82 131.44,83.19 127.64,83.19 126.94,83.88 C19.+
  Top 1.27: EXP.A32 EXP.B32 EXP.C32 C31.+ | TP1.1 141.02,83.87 C24.1
  Bottom 0.254: C19.+ 122.87,89.15 122.87,97.16 70.17,97.16 70.17,96.52 | CON99.1 CON99.2 54.93,96.52 57.47,96.52 | 57.47,96.52 R34.1 | 57.47,96.52 60.01,96.52 | 60.01,96.52 R36.1 | 60.01,96.52 62.55,96.52 | 62.55,96.52 R42.1 | 62.55,96.52 65.09,96.52 | 65.09,96.52 R43.1 | 65.09,96.52 67.63,96.52 | 67.63,96.52 R44.1 | 67.63,96.52 70.17,96.52 | 70.17,96.52 R45.1 | R41.1 70.17,79.06 67.63,79.06 | 67.63,79.06 R40.1 | 65.09,79.06 67.63,79.06 | 65.09,79.06 R39.1 | 62.55,79.06 65.09,79.06 | 62.55,79.06 R38.1 | 60.01,79.06 62.55,79.06 | 60.01,79.06 R37.1 | 60.01,79.06 57.47,79.06 R35.1
  Bottom 0.61: C31.+ 144.46,41.59 v142.88,43.18
  Bottom 1.016: EXP.C3 TP1.1 140.65,86.68 136.84,86.68 136.53,87 133.03,87 132.08,86.04 C32.+
  other vias: 132.08,85.09
VCCINT  (via drill 0.51)  (5 unrouted)
  Top 0.254: C10.2 112.96,41.66 112.08,42.55 111.55,42.55 IC7.56 102.87,51.23 | C7.2 91.19,38.17 91.76,38.73 91.76,39.33 IC7.19 96.2,43.78 96.2,45.09 102.23,51.12 102.87,51.12 102.87,51.23 | 120.02,92.39 IC2.3 | v115.57,61.91 115.4,61.91 | 102.87,51.23 107.84,56.2 v107.95,56.2 | IC7.126 93.98,59.41 93.98,60.33 93.42,60.89 C16.2 | IC7.90 112.32,59.9 C13.2
  Top 1.27: 120.02,92.39 108.9,92.39 106.68,90.17
  Bottom 0.254: v115.57,61.91 112.39,72.07 | C6.+ 102.17,67.69 107.95,61.91 v107.95,56.2
  other vias: 94.93,62.55
  pour Top (isolate 0.61, no thermals): 131.13,97.16 131.13,82.87 112.71,82.87 112.71,97.16
VDUINT
  Top 0.254: IC7.73 116.51,52.07 129.12,52.07 R24.1
WS-3V3
  Top 0.254: IC7.94 120.98,71.39 122.4,71.39 R25.1

## Text on the board
tNames: 640x400 75 Hz | MIC | GND | GND | EAR | !VS | !HS | B | G | R | Video out | 1V8 | VGA | IRQ3 | IRQ4 | IRQ | IRQ2 | (c) 2012 AlexiosC | http://www.bedroomlan.org/cft | JTAG | CFT Minicomputer Video Display Unit rev E